# Altium schematic sheet 10cm-chip-cal-board-1point2in.SchDoc
size A; SheetNumber: 1; SheetTotal: 1
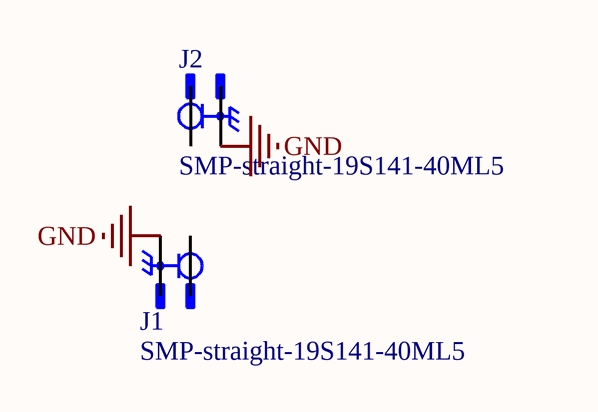
[diagram p0: 10cm-chip-cal-board-1point2in.SchDoc]

## Parts
J1  SMP-straight-19S141-40ML5  [rosenberger-19S141-40ML5]
J2  SMP-straight-19S141-40ML5  [rosenberger-19S141-40ML5]

## Nets
GND: J1.gnd J2.gnd

Not connected (* = marked no-connect by the designer): J1 1; J2 1

## Library data of the parts
J1 J2 = SMP-straight-19S141-40ML5: SMP Connector Plug, Male Pin 50Ohm Surface Mount Solder; MP: 853050232; MF: Molex; Check_prices: https://www.snapeda.com/parts/853050232/Molex/view-part/?ref=eda; Value: *; Availability: In Stock; Price: None; Package: None; SnapEDA_Link: https://www.snapeda.com/parts/853050232/Molex/view-part/?ref=snap; Purchase-URL: https://pricing.snapeda.com/search/part/853050232/?ref=eda; Supplier 1: Mouser; Supplier Part Number 1: 476-19S201-40ML5